# Altium project 24.069.PrjPCB
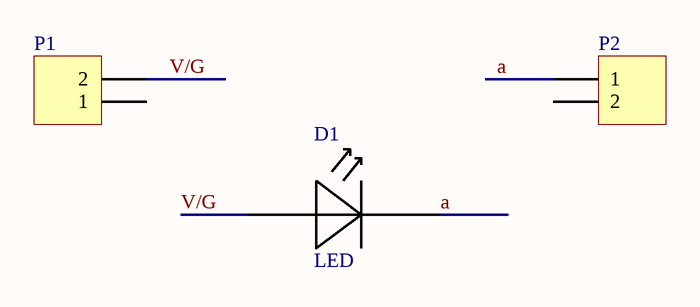
[diagram p0: 24.069.SchDoc]
1 sheet, 3 parts. Net scope: global (net labels, ports and power ports of the same name join across sheets).
Board file: 24.069.PcbDoc

## Sheet 24.069.SchDoc
size A4

### Parts
D1  LED  [LED]
P1  Header 2  [HDR1X2]  (value not drawn)
P2  Header 2  [HDR1X2]  (value not drawn)

### Nets
a: D1.2 P2.1
V/G: D1.1 P1.2

Not connected (* = marked no-connect by the designer): P1 1; P2 2

### Library data of the parts
P1 P2 = Header 2: Header, 2-Pin; LatestRevisionDate: 17-Jul-2002; LatestRevisionNote: Re-released for DXP Platform.; Publisher: Altium Limited